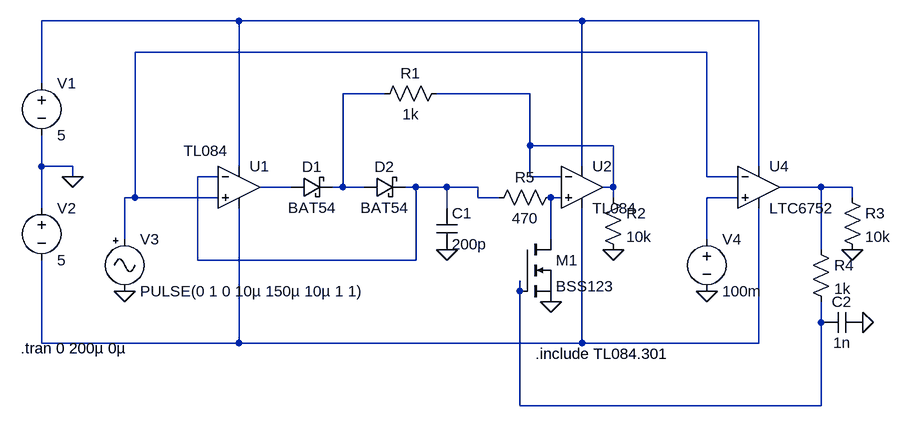
[diagram p0: schematic peakhold.asc]
peakhold.asc, the LTspice schematic file:
Version 4
SHEET 1 1348 680
WIRE 144 -128 -160 -128
WIRE 672 -128 144 -128
WIRE 944 -128 672 -128
WIRE 864 -80 -16 -80
WIRE -160 -32 -160 -128
WIRE 368 -16 304 -16
WIRE 592 -16 448 -16
WIRE 592 64 592 -16
WIRE 720 64 592 64
WIRE -160 96 -160 48
WIRE -112 96 -160 96
WIRE 144 96 144 -128
WIRE 672 96 672 -128
WIRE 944 96 944 -128
WIRE -112 112 -112 96
WIRE 112 112 80 112
WIRE 592 112 592 64
WIRE 640 112 592 112
WIRE 864 112 864 -80
WIRE 912 112 864 112
WIRE 224 128 176 128
WIRE 304 128 304 -16
WIRE 304 128 288 128
WIRE 336 128 304 128
WIRE 416 128 400 128
WIRE 464 128 416 128
WIRE 512 128 464 128
WIRE 720 128 720 64
WIRE 720 128 704 128
WIRE 1040 128 976 128
WIRE 1088 128 1040 128
WIRE -16 144 -16 -80
WIRE -16 144 -32 144
WIRE 112 144 -16 144
WIRE 512 144 512 128
WIRE 544 144 512 144
WIRE 640 144 624 144
WIRE 720 144 720 128
WIRE 912 144 864 144
WIRE 1088 144 1088 128
WIRE -160 160 -160 96
WIRE 464 160 464 128
WIRE -32 208 -32 144
WIRE 624 208 624 144
WIRE 864 208 864 144
WIRE 1040 224 1040 128
WIRE 80 240 80 112
WIRE 416 240 416 128
WIRE 416 240 80 240
WIRE 576 288 576 272
WIRE 1040 336 1040 304
WIRE -160 368 -160 240
WIRE 144 368 144 160
WIRE 144 368 -160 368
WIRE 672 368 672 160
WIRE 672 368 144 368
WIRE 944 368 944 160
WIRE 944 368 672 368
WIRE 576 464 576 288
WIRE 1040 464 1040 336
WIRE 1040 464 576 464
FLAG -112 112 0
FLAG 464 224 0
FLAG 720 224 0
FLAG -32 288 0
FLAG 1088 224 0
FLAG 864 288 0
FLAG 1104 336 0
FLAG 624 304 0
SYMBOL voltage -160 -48 R0
WINDOW 123 0 0 Left 2
WINDOW 39 0 0 Left 2
SYMATTR InstName V1
SYMATTR Value 5
SYMBOL voltage -160 144 R0
WINDOW 123 0 0 Left 2
WINDOW 39 0 0 Left 2
SYMATTR InstName V2
SYMATTR Value 5
SYMBOL schottky 336 144 R270
WINDOW 0 32 32 VTop 2
WINDOW 3 0 32 VBottom 2
SYMATTR InstName D2
SYMATTR Value BAT54
SYMATTR Description Diode
SYMATTR Type diode
SYMBOL cap 448 160 R0
SYMATTR InstName C1
SYMATTR Value 200p
SYMBOL schottky 224 144 R270
WINDOW 0 32 32 VTop 2
WINDOW 3 0 32 VBottom 2
SYMATTR InstName D1
SYMATTR Value BAT54
SYMATTR Description Diode
SYMATTR Type diode
SYMBOL res 464 -32 R90
WINDOW 0 0 56 VBottom 2
WINDOW 3 32 56 VTop 2
SYMATTR InstName R1
SYMATTR Value 1k
SYMBOL res 704 128 R0
SYMATTR InstName R2
SYMATTR Value 10k
SYMBOL Misc\\signal -32 192 R0
WINDOW 123 0 0 Left 2
WINDOW 39 0 0 Left 2
SYMATTR InstName V3
SYMATTR Value PULSE(0 1 0 10µ 150µ 10µ 1 1)
SYMBOL Opamps\\opamp2 144 64 R0
WINDOW 3 -85 8 Left 2
SYMATTR Value TL084
SYMATTR InstName U1
SYMBOL Opamps\\opamp2 672 64 R0
SYMATTR InstName U2
SYMATTR Value TL084
SYMBOL res 1072 128 R0
SYMATTR InstName R3
SYMATTR Value 10k
SYMBOL voltage 864 192 R0
WINDOW 123 0 0 Left 2
WINDOW 39 0 0 Left 2
SYMATTR InstName V4
SYMATTR Value 100m
SYMBOL res 1024 208 R0
SYMATTR InstName R4
SYMATTR Value 1k
SYMBOL Comparators\\LTC6752 944 64 R0
SYMATTR InstName U4
SYMBOL cap 1104 320 R90
WINDOW 0 0 32 VBottom 2
WINDOW 3 32 32 VTop 2
SYMATTR InstName C2
SYMATTR Value 1n
SYMBOL res 640 128 R90
WINDOW 0 0 56 VBottom 2
WINDOW 3 32 56 VTop 2
SYMATTR InstName R5
SYMATTR Value 470
SYMBOL nmos 576 208 R0
SYMATTR InstName M1
SYMATTR Value BSS123
TEXT -192 376 Left 2 !.tran 0 200µ 0µ
TEXT 600 384 Left 2 !.include TL084.301

The netlist it stands for:
* peakhold.asc
V1 N001 0 5
V2 0 N011 5
D2 N003 N005 BAT54
C1 N005 0 200p
D1 N006 N003 BAT54
R1 N004 N003 1k
R2 N004 0 10k
V3 N002 0 PULSE(0 1 0 10µ 150µ 10µ 1 1)
XU1 N002 N005 N001 N011 N006 TL084  ; pins In+ In- V+ V- OUT
XU2 N008 N004 N001 N011 N004 TL084  ; pins In+ In- V+ V- OUT
R3 N007 0 10k
V4 N009 0 100m
R4 N007 N010 1k
XU4 N009 N002 N001 N011 N007 LTC6752  ; pins In+ In- V+ V- OUT
C2 0 N010 1n
R5 N008 N005 470
M1 N008 N010 0 0 BSS123
.model D D
.lib standard.dio
.model NMOS NMOS
.model PMOS PMOS
.lib standard.mos
.tran 0 200µ 0µ
.include TL084.301
.lib LTC7.lib
.backanno
.end